# EAGLE design adpicd2 (EAGLE 6.2)
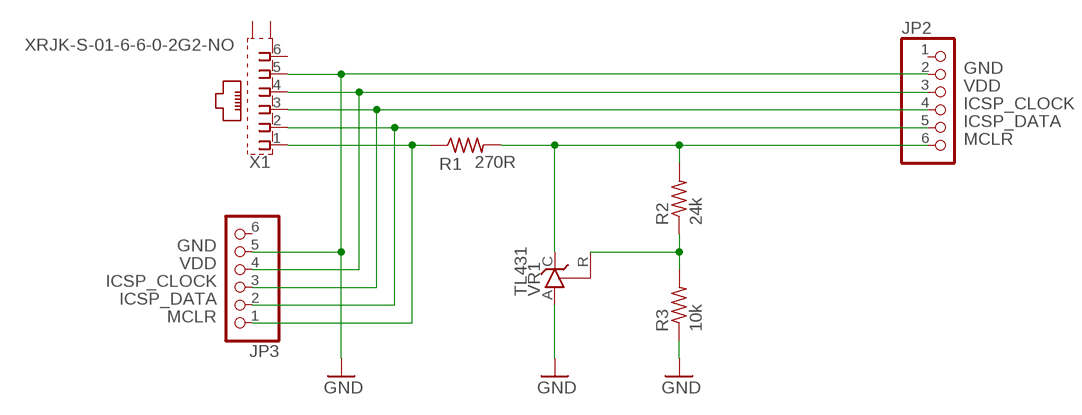
[diagram p0: schematic, sheet 1]

## Parts
JP2  PINHD-1X6  [1X06]
JP3  PINHD-1X6  [1X06]
R1  270R  R-US_0204/5  [0204/5]
R2  24k  R-US_0204/5  [0204/5]
R3  10k  R-US_0204/5  [0204/5]
VR1  TL431  TL431CLP  [TO92-CLP]
X1  XRJK-S-01-6-6-0-2G2-NO  [XRJK-S-01-6-6-0-2G2-NO]

## Nets
GND: JP2.2 JP3.5 R3.1 VR1.A X1.5
N$1: R2.1 R3.2 VR1.R
N$2: JP2.6 R1.2 R2.2 VR1.C
N$3: JP3.1 R1.1 X1.1
N$4: JP2.3 JP3.4 X1.4
N$6: JP2.5 JP3.2 X1.2
N$8: JP2.4 JP3.3 X1.3
Unconnected: JP2.1 JP3.6 X1.6 X1.S1(S) X1.S2(S)

## Notes on the sheet
- GND
- VDD
- ICSP_CLOCK
- ICSP_DATA
- MCLR
- GND
- VDD
- ICSP_CLOCK
- ICSP_DATA
- MCLR

## Library data of the parts
JP2 JP3 = pinhead:PINHD-1X6: PIN HEADER
R1-R3 = rcl:R-US_: RESISTOR, American symbol
VR1 = v-reg:TL431CLP: VOLTAGE REGULATOR
X1 = con-xmultiple:XRJK*6: RJ11 Connector without LED, 6 position, 6 contacts, shielded, thrue hole Source: XRJK-S-01-6-6-0-2G2-NO(01).pdf

## Board
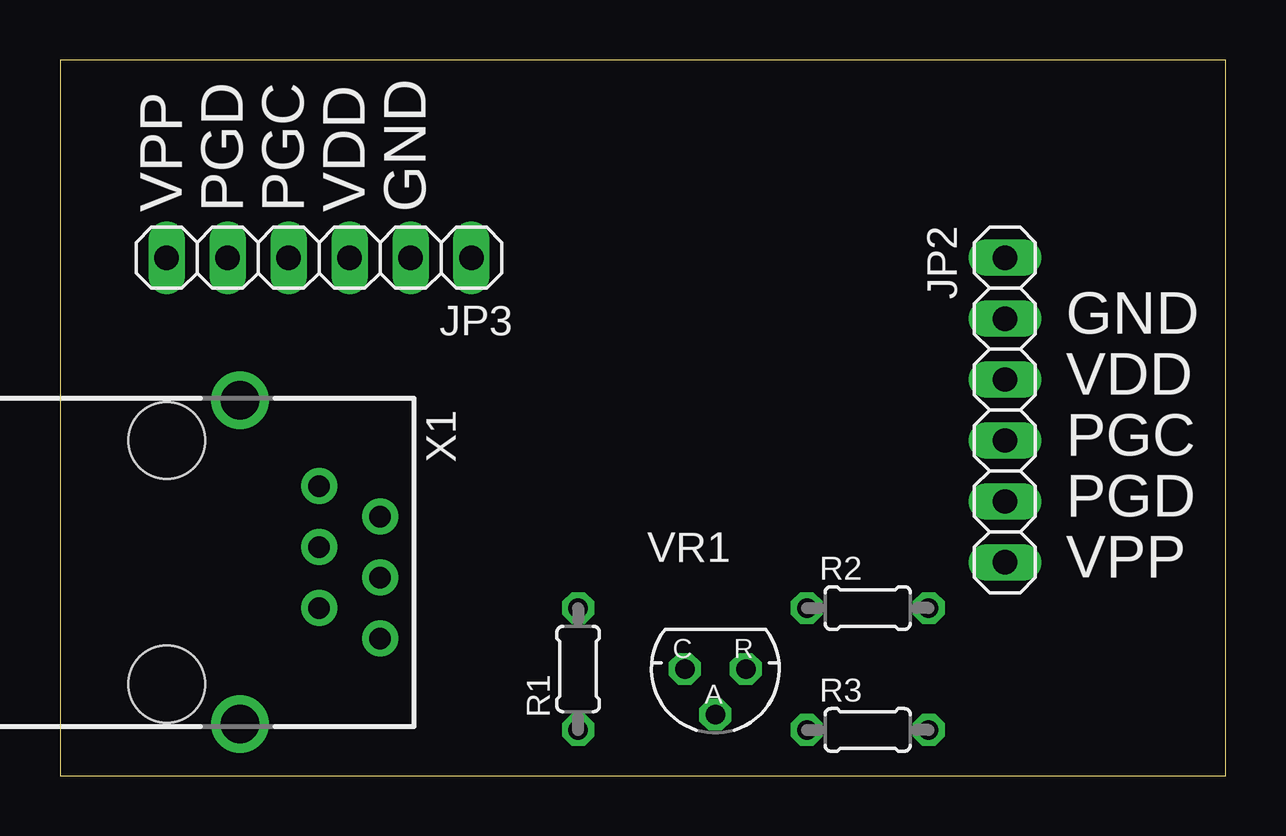
[diagram p1: board, top side]
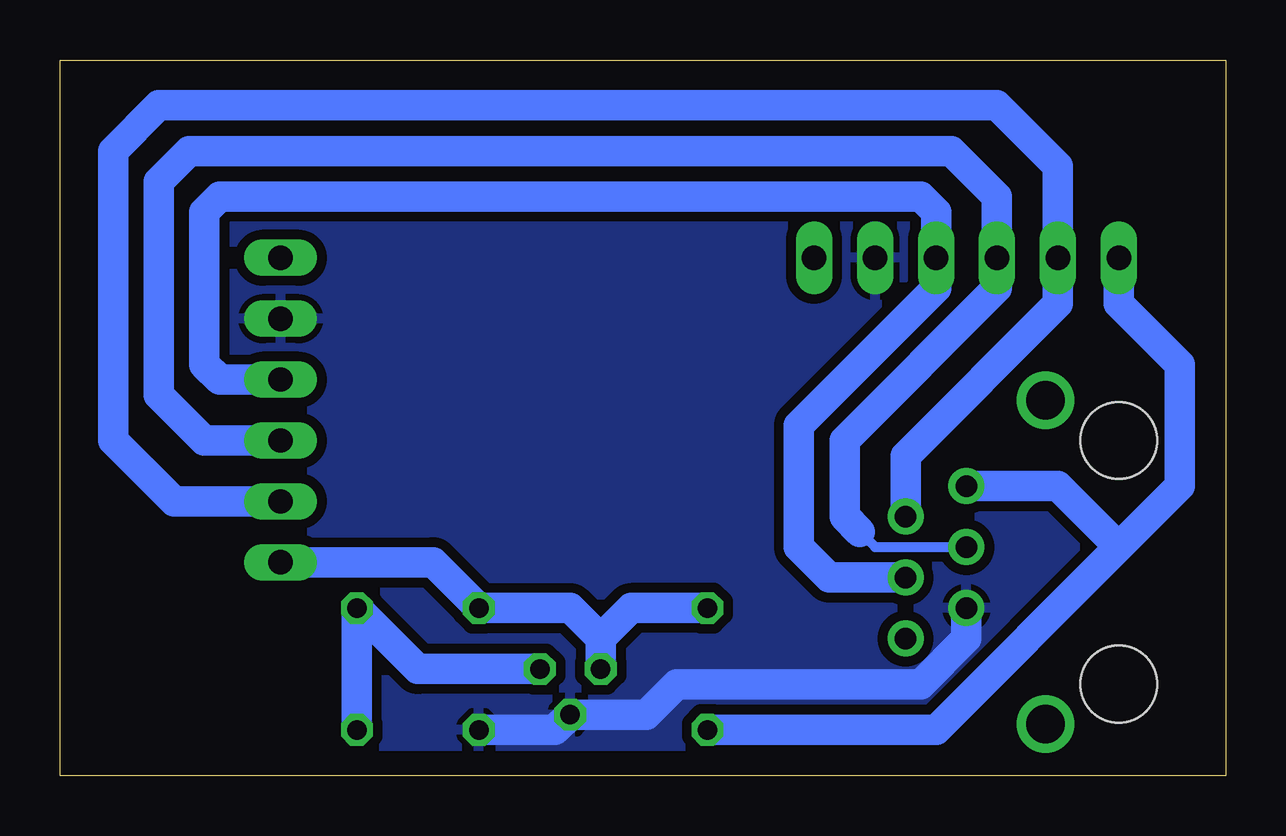
[diagram p2: board, bottom side, seen from below]

Size 48.56 x 29.84 mm. Coordinates in mm from the lower left corner, seen from the top.
Outline: 0,0 48.56,0 48.56,29.84 0,29.84 0,0
Copper layers (1*16): Top 0mil / dielectric 1.5mm / Bottom 0.035mm
Design rules: minimum track width 10mil, minimum drill 24mil, track to track 8mil, track to pad 8mil, pad to pad 8mil, via to via 8mil, smd to smd 8mil, copper to edge 40mil, drill to drill 8mil, minimum pad ring 10mil, minimum via ring 8mil, stop-mask expansion 4mil, vias tented up to drill 0mil, thermal gap 10mil

### Footprints (pad centres in the part's own frame; a part is rotated, then mirrored left to right if it is on the bottom)
1X06 = drill 1.016 long: 1 -6.35,0; 2 -3.81,0; 3 -1.27,0; 4 1.27,0; 5 3.81,0; 6 6.35,0
0204/5 = drill 0.813 octagon: 1 -2.54,0; 2 2.54,0
TO92-CLP = drill 0.813 octagon: A 0,1.905; C 1.27,0; R -1.27,0
XRJK-S-01-6-6-0-2G2-NO = drill 0.9 pad 1.5: 1 -3.175,6.35; 2 -1.905,8.89; 3 -0.635,6.35; 4 0.635,8.89; 5 1.905,6.35; 6 3.175,8.89 | drill 1.6 pad 2.184: S1 -6.75,3.05; S2 6.75,3.05 | hole 3.2: -5.08,0; 5.08,0

### Placement (x,y rotation side)
JP2  39.37,15.24 270 top
JP3  10.79,21.59 0 top
R1  21.59,4.45 90 top
R2  33.66,6.99 180 top
R3  33.66,1.91 0 top
VR1  27.3,4.45 180 top
X1  4.45,8.89 270 top

### Tracks (layer width: path | path; a pad name or v marks a point on that pad's centre or on a via)
GND
  Bottom 1.27: R3.1 27.94,1.91 VR1.A 24.13,2.54 22.86,3.81 12.7,3.81 10.79,5.71 X1.5
  pour Bottom (isolate 0.406): 0,30.48 0,0 48.9,0 48.9,30.48
N$1
  Bottom 1.27: R3.2 R2.1 33.66,4.45 VR1.R
N$2
  Bottom 1.27: R1.2 24.77,6.99 26.04,5.71 | 26.04,5.71 27.3,6.99 R2.2 33.02,8.89 JP2.6 | 26.04,5.71 VR1.C
N$3
  Bottom 1.27: R1.1 12.06,1.91 4.45,9.53 | 4.45,9.53 1.91,12.06 1.91,17.14 4.45,19.68 JP3.1 | X1.1 6.99,12.06 4.45,9.53
N$4
  Bottom 1.27: JP2.3 41.91,16.51 42.55,17.14 42.55,23.5 41.91,24.13 12.7,24.13 12.06,23.5 JP3.4 12.06,20.32 17.78,14.61 17.78,9.53 16.51,8.26 X1.4
N$6
  Bottom 1.27: X1.2 13.34,13.34 6.99,19.68 JP3.2 6.99,25.4 9.53,27.94 44.45,27.94 46.35,26.04 46.35,13.97 43.81,11.43 JP2.5
N$8
  Bottom 0.406: 15.24,10.16 14.61,9.53 X1.3
  Bottom 1.27: JP2.4 42.55,13.97 44.45,15.88 44.45,24.77 43.18,26.04 11.43,26.04 9.53,24.13 JP3.3 9.53,20.32 15.88,13.97 15.88,10.79 15.24,10.16

### Text on the board
tNames: VPP | PGD | PGC | VDD | GND | GND | VDD | PGC | PGD | VPP